# Altium schematic sheet Main.SchDoc
size A4; SheetNumber: 1; SheetTotal: 5
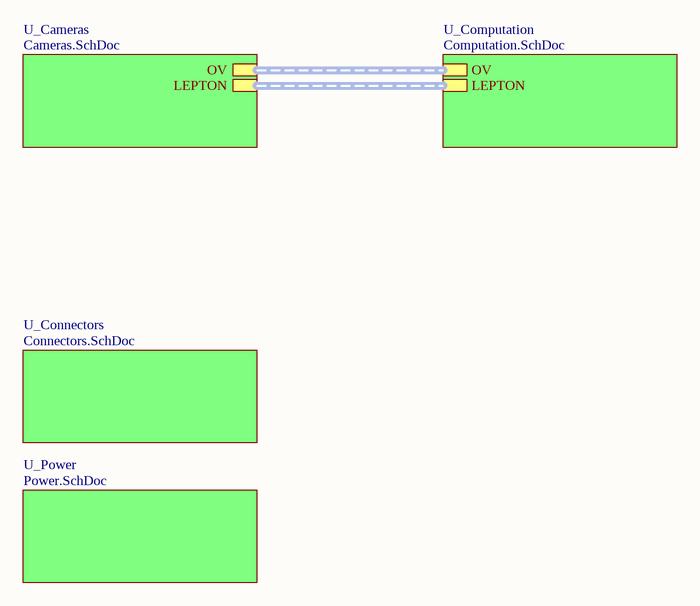
[diagram p0: Main.SchDoc]

## Sub-sheets
U_Cameras = Cameras.SchDoc: OV (harness OV), LEPTON (harness LEPTON)
U_Computation = Computation.SchDoc: OV (harness OV), LEPTON (harness LEPTON)
U_Connectors = Connectors.SchDoc: no entries
U_Power = Power.SchDoc: no entries

## Buses and harness runs
harness sheet U_Cameras/LEPTON = sheet U_Computation/LEPTON
harness sheet U_Cameras/OV = sheet U_Computation/OV